# EAGLE design Week09_InputDevice_MicBoard_ADLL_FabAcademy2014 (EAGLE 6.5.0)
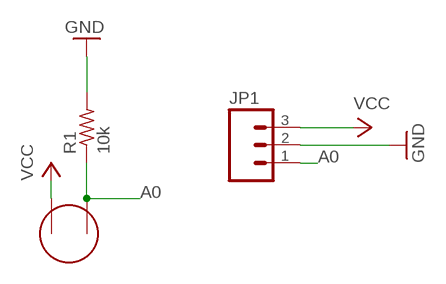
[diagram p0: schematic, sheet 1]

## Parts
JP1  M03PTH  [1X03]
R1  10k  RESISTOR1206  [1206]
U$2  ELECTRET  [ELECTRET_2742PBJ-A]

## Nets
A0: JP1.1 R1.1 U$2.P$1
GND: JP1.2 R1.2
VCC: JP1.3 U$2.P$2

## Library data of the parts
JP1 = 01_SparkFun:M03: Header 3 Standard 3-pin 0.1" header. Use with straight break away headers (SKU : PRT-00116), right angle break away headers (PRT-00553), swiss pins (PRT-00743), machine pins (PRT-00117), and female headers (PRT-00115). Molex polarized connector foot print use with SKU : PRT-08232 with associated crimp pins and housings.
R1 = 01_FAB_Hello:RESISTOR
U$2 = 01_fab:ELECTRET

## Board
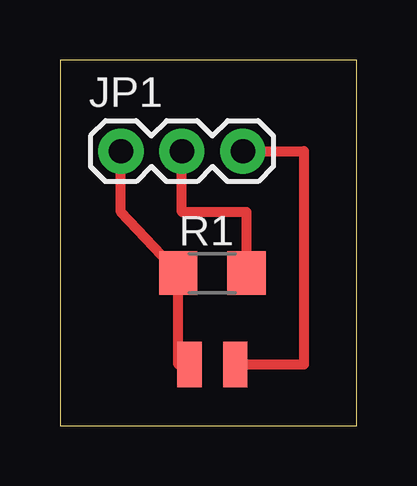
[diagram p1: board, top side]

Size 12.37 x 15.23 mm. Coordinates in mm from the lower left corner, seen from the top.
Outline: 0,0 12.37,0 12.37,15.23 0,15.23 0,0
Copper layers (1*16): Top 0.035mm / dielectric 1.5mm / Bottom 0.035mm
Design rules "default": minimum track width 10mil, minimum drill 24mil, track to track 8mil, track to pad 8mil, pad to pad 8mil, via to via 8mil, smd to smd 8mil, copper to edge 40mil, drill to drill 8mil, minimum pad ring 10mil, minimum via ring 8mil, stop-mask expansion 4mil, vias tented up to drill 0mil, thermal gap 10mil

### Footprints (pad centres in the part's own frame; a part is rotated, then mirrored left to right if it is on the bottom)
1X03 = drill 1.016 pad 1.88: 1 0,0; 2 2.54,0; 3 5.08,0
1206 = smd 1.6 x 1.803: 1 -1.422,0; 2 1.422,0
ELECTRET_2742PBJ-A = smd 1.016 x 1.905: P$1 -0.953,0; P$2 0.953,0

### Placement (x,y rotation side)
JP1  2.54,11.43 0 top
R1  6.35,6.35 0 top
U$2  6.35,2.54 0 top

### Tracks (layer width: path | path; a pad name or v marks a point on that pad's centre or on a via)
A0
  Top 0.406: U$2.P$1 4.93,2.54 R1.1 2.54,8.89 JP1.1
GND
  Top 0.406: R1.2 7.77,8.89 5.08,8.89 JP1.2
VCC
  Top 0.406: JP1.3 10.16,11.43 10.16,2.54 U$2.P$2